# Altium project SensorStation2_Project.PrjPcb
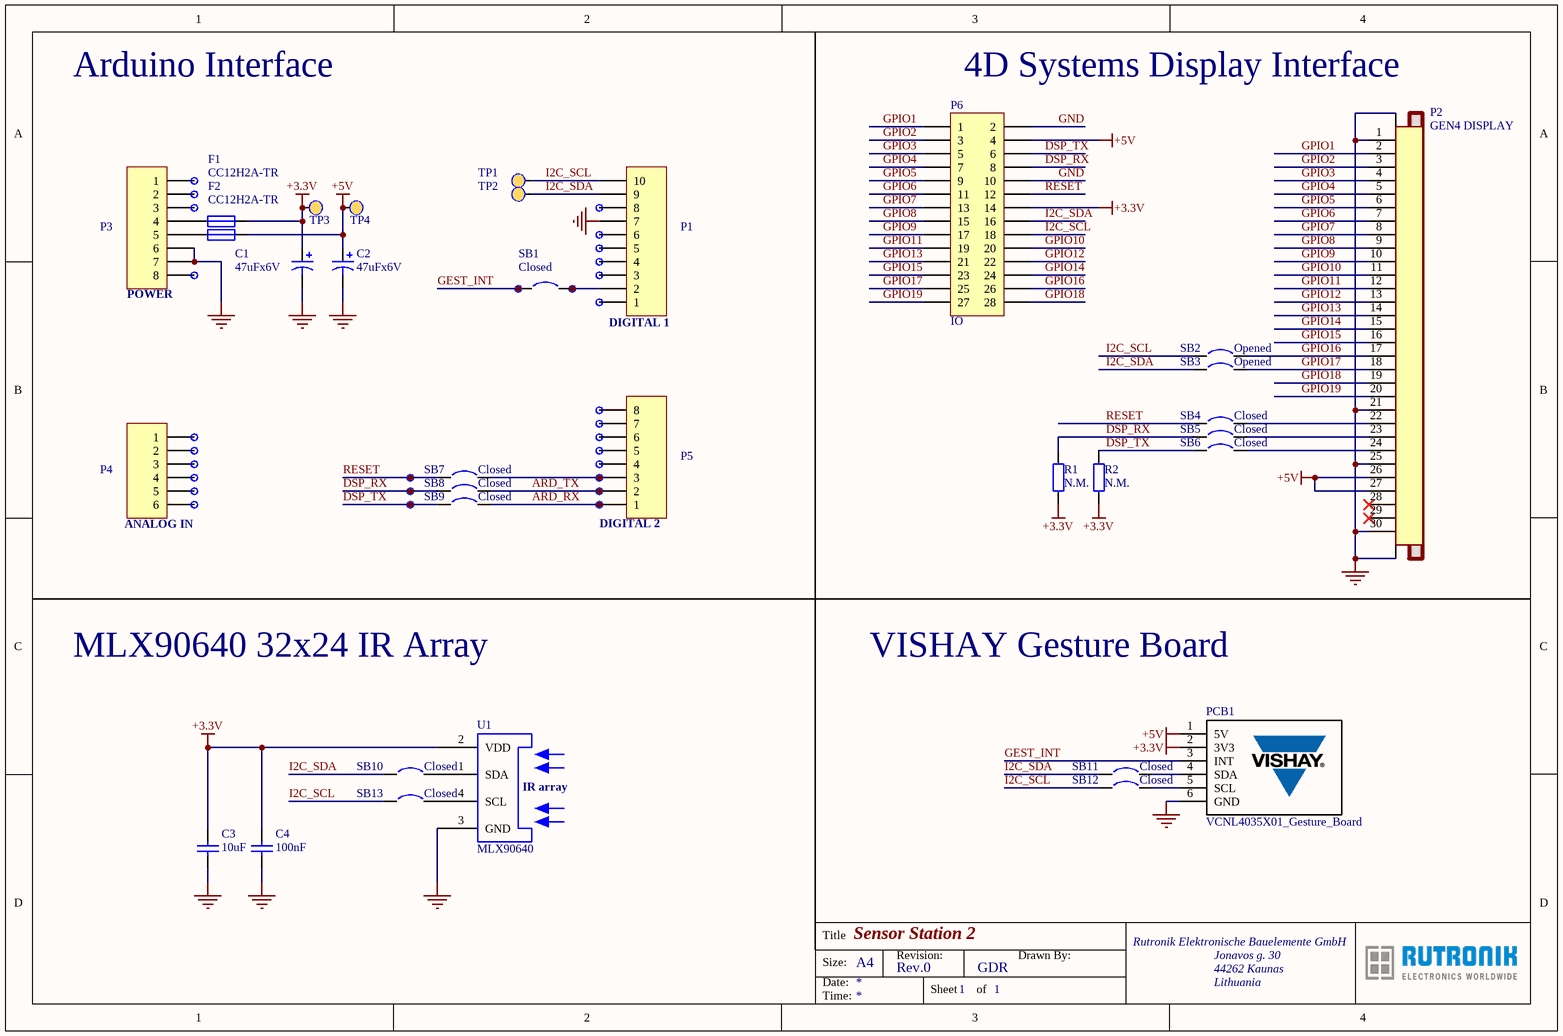
[diagram p0: Schematic.SchDoc]
1 sheet, 62 parts. Net scope: global (net labels, ports and power ports of the same name join across sheets).
Board file: SS2_PCB.PcbDoc

## Sheet Schematic.SchDoc: Sensor Station 2
size A4; DrawnBy: GDR; Organization: Rutronik Elektronische Bauelemente GmbH; Address1: Jonavos g. 30; Address2: 44262 Kaunas; Address3: Lithuania; Revision: Rev.0; SheetNumber: 1; SheetTotal: 1

### Parts
C1  value 47uFx6V  [Case-B]
C2  value 47uFx6V  [Case-B]
C3  value 10uF  [C0805]  (hidden comment: Cap Semi)
C4  value 100nF  [C0805]  (hidden comment: Cap Semi)
F1  CC12H2A-TR  [FUSE1206]
F2  CC12H2A-TR  [FUSE1206]
J1  pin_tht  [PIN_THT]  (value not drawn)  (no BOM)
J2  pin_tht  [PIN_THT]  (value not drawn)  (no BOM)
J3  pin_tht  [PIN_THT]  (value not drawn)  (no BOM)
J4  pin_tht  [PIN_THT]  (value not drawn)  (no BOM)
J5  pin_tht  [PIN_THT]  (value not drawn)  (no BOM)
J6  pin_tht  [PIN_THT]  (value not drawn)  (no BOM)
J7  pin_tht  [PIN_THT]  (value not drawn)  (no BOM)
J8  pin_tht  [PIN_THT]  (value not drawn)  (no BOM)
J9  pin_tht  [PIN_THT]  (value not drawn)  (no BOM)
J10  pin_tht  [PIN_THT]  (value not drawn)  (no BOM)
J11  pin_tht  [PIN_THT]  (value not drawn)  (no BOM)
J12  pin_tht  [PIN_THT]  (value not drawn)  (no BOM)
J13  pin_tht  [PIN_THT]  (value not drawn)  (no BOM)
J14  pin_tht  [PIN_THT]  (value not drawn)  (no BOM)
J15  pin_tht  [PIN_THT]  (value not drawn)  (no BOM)
J16  pin_tht  [PIN_THT]  (value not drawn)  (no BOM)
J17  pin_tht  [PIN_THT]  (value not drawn)  (no BOM)
J18  pin_tht  [PIN_THT]  (value not drawn)  (no BOM)
J19  pin_tht  [PIN_THT]  (value not drawn)  (no BOM)
J20  pin_tht  [PIN_THT]  (value not drawn)  (no BOM)
J21  pin_tht  [PIN_THT]  (value not drawn)  (no BOM)
J22  pin_tht  [PIN_THT]  (value not drawn)  (no BOM)
J23  pin_tht  [PIN_THT]  (value not drawn)  (no BOM)
J24  pin_tht  [PIN_THT]  (value not drawn)  (no BOM)
J25  pin_tht  [PIN_THT]  (value not drawn)  (no BOM)
J26  pin_tht  [PIN_THT]  (value not drawn)  (no BOM)
J27  pin_tht  [PIN_THT]  (value not drawn)  (no BOM)
J28  pin_tht  [PIN_THT]  (value not drawn)  (no BOM)
J29  pin_tht  [PIN_THT]  (value not drawn)  (no BOM)
P1  DIGITAL 1  [HDR1X10_ARDUINO]
P2  GEN4 DISPLAY  [Molex_30pin]
P3  POWER  [HDR1X8_ARDUINO]
P4  ANALOG IN  [HDR1X6_ARDUINO]
P5  DIGITAL 2  [HDR1X8_ARDUINO]
P6  IO  [HDR2X14]  (no BOM)
PCB1  VCNL4035X01_Gesture_Board  [VCNL4035X01_Gesture_Board]
R1  value N.M.  [R0402]  (hidden comment: Res2)  (no BOM)
R2  value N.M.  [R0402]  (hidden comment: Res2)  (no BOM)
SB1  Closed  [SB_0402]
SB2  Opened  [SB_0402 - open]  (no BOM)
SB3  Opened  [SB_0402 - open]  (no BOM)
SB4  Closed  [SB_0402]
SB5  Closed  [SB_0402]
SB6  Closed  [SB_0402]
SB7  Closed  [SB_0402]
SB8  Closed  [SB_0402]
SB9  Closed  [SB_0402]
SB10  Closed  [SB_0402]
SB11  Closed  [SB_0402]
SB12  Closed  [SB_0402]
SB13  Closed  [SB_0402]
TP1  Test_Point  [TEST_POINT]  (value not drawn)  (no BOM)
TP2  Test_Point  [TEST_POINT]  (value not drawn)  (no BOM)
TP3  Test_Point  [TEST_POINT]  (value not drawn)  (no BOM)
TP4  Test_Point  [TEST_POINT]  (value not drawn)  (no BOM)
U1  MLX90640  [TO39-4]

### Nets
+3.3V: C1.1 C3.1 C4.1 F1.1 P6.14 PCB1.2(3V3) R1.2 R2.2 TP3.0 U1.2(VDD)
+5V: C2.1 F2.1 P2.26 P2.27 P6.4 PCB1.1(5V) TP4.0
GND: C1.2 C2.2 C3.2 C4.2 P1.7 P2.1 P2.21 P2.25 P2.30 P2.31 P2.32 P3.6 P3.7 P6.2 P6.10 PCB1.6(GND) U1.3(GND)
ARD_RX: J24.1 P5.1 SB9.2
ARD_TX: J21.1 P5.2 SB8.2
DSP_RX: J20.1 P6.8 R1.1 SB5.1 SB8.1
DSP_TX: J23.1 P6.6 R2.1 SB6.1 SB9.1
GEST_INT: J5.1 PCB1.3(INT) SB1.1
GPIO1: P2.2 P6.1
GPIO2: P2.3 P6.3
GPIO3: P2.4 P6.5
GPIO4: P2.5 P6.7
GPIO5: P2.6 P6.9
GPIO6: P2.7 P6.11
GPIO7: P2.8 P6.13
GPIO8: P2.9 P6.15
GPIO9: P2.10 P6.17
GPIO10: P2.11 P6.20
GPIO11: P2.12 P6.19
GPIO12: P2.13 P6.22
GPIO13: P2.14 P6.21
GPIO14: P2.15 P6.24
GPIO15: P2.16 P6.23
GPIO16: P2.17 P6.26 SB2.2
GPIO17: P2.18 P6.25 SB3.2
GPIO18: P2.19 P6.28
GPIO19: P2.20 P6.27
I2C_SCL: P1.10 P6.18 SB2.1 SB12.1 SB13.1 TP1.0
I2C_SDA: P1.9 P6.16 SB3.1 SB10.1 SB11.1 TP2.0
RESET: J17.1 P6.12 SB4.1 SB7.1
NetF1_2: F1.2 P3.4
NetF2_2: F2.2 P3.5
NetJ1_1: J1.1 P1.6
NetJ2_1: J2.1 P1.5
NetJ3_1: J3.1 P1.4
NetJ4_1: J4.1 P1.3
NetJ6_1: J6.1 P1.2 SB1.2
NetJ7_1: J7.1 P1.1
NetJ8_1: J8.1 P5.8
NetJ9_1: J9.1 P5.7
NetJ10_1: J10.1 P4.1
NetJ11_1: J11.1 P5.6
NetJ12_1: J12.1 P4.2
NetJ13_1: J13.1 P5.5
NetJ14_1: J14.1 P4.3
NetJ15_1: J15.1 P5.4
NetJ16_1: J16.1 P4.4
NetJ18_1: J18.1 P5.3 SB7.2
NetJ19_1: J19.1 P4.5
NetJ22_1: J22.1 P4.6
NetJ25_1: J25.1 P3.1
NetJ26_1: J26.1 P3.2
NetJ27_1: J27.1 P3.3
NetJ28_1: J28.1 P1.8
NetJ29_1: J29.1 P3.8
NetP2_22: P2.22 SB4.2
NetP2_23: P2.23 SB5.2
NetP2_24: P2.24 SB6.2
NetPCB1_4: PCB1.4(SDA) SB11.2
NetPCB1_5: PCB1.5(SCL) SB12.2
NetSB10_2: SB10.2 U1.1(SDA)
NetSB13_2: SB13.2 U1.4(SCL)

Not connected (* = marked no-connect by the designer): P2 28* 29*

### Notes on the sheet
- Arduino Interface
- 4D Systems Display Interface
- MLX90640 32x24 IR Array
- VISHAY Gesture Board
- Title
- Size:
- Date:
- A4
- Revision:
- Drawn By:
- Time:
- Sheet
- of
- (in symbol MLX90640) IR array

### Library data of the parts
C1 C2 = Cap Pol1: Manufacturer: AVX; Manufacturer Part No.: NOJB476M004RWJ; Part Description: Niobium Oxide Capacitor; Specification: 6V, 20%; Supplier: Rutronik; Supplier part number: NOJB476M004RWJ; Link: https://www.rutronik24.com/product/avx/nojb476m004rwj/11635685.html
C3 = Cap Semi: Capacitor (Semiconductor SIM Model); Manufacturer: Samsung EM; Manufacturer Part No.: CGA4J1X7R0J106K125AC; Part Description: Ceramic Capacitor; Specification: X5R, 6.3V, 10%; Supplier: Rutronik; Supplier part number: KKA1042; Link: https://www.rutronik24.com/product/tdk/cga4j1x7r0j106k125ac/14305457.html
C4 = Cap Semi: Capacitor (Semiconductor SIM Model); Manufacturer: TDK; Manufacturer Part No.: CGA2B3X7R1H104K050BB; Part Description: Ceramic Capacitor; Specification: X7R, 50V, 10%; Supplier: Rutronik; Supplier part number: KKA1277; Link: https://www.rutronik24.com/product/tdk/cga2b3x7r1h104k050bb/15441483.html
F1 F2 = Fuse: Manufacturer: EATON; Part Description: High I²t Chip fuse; Specification: 63V, 2A; Link: https://www.rutronik24.com/search-result/qs:CC12H2A-TR/reset:0; Manufacturer Part No.: CC12H2A-TR; Supplier: Rutronik; Supplier part number: FUSE10755; Value: CC12H2A-TR
J1-J29 = pin_tht: Through-hole pin for wire connection.
P1 = Header 10: Manufacturer: ADAM TECH; Manufacturer Part No.: RS1-10-G-413; Part Description: Arduino Connector; Specification: 10 pos. 2,54mm; Value: RS1-10-G-413; Supplier: Rutronik; Supplier part number: CONN9323; Link: http://www.adam-tech.com/products.php
P2 = Molex_30pin: Easy-On FFC/FPC Connector
P3 P5 = Header 8: Manufacturer: ADAM TECH; Manufacturer Part No.: RS1-08-G-413; Part Description: Arduino Connector; Specification: 8 pos. 2,54mm; Value: RS1-08-G-413; Supplier: Rutronik; Supplier part number: CONN9321; Link: http://www.adam-tech.com/products.php
P4 = Header 6: Manufacturer: ADAM TECH; Manufacturer Part No.: RS1-06-G-413; Part Description: Arduino Connector; Specification: 6 pos. 2,54mm; Value: RS1-06-G-413; Supplier: Rutronik; Supplier part number: CONN9319; Link: http://www.adam-tech.com/products.php
P6 = Header 14X2: Header, 14-Pin, Dual row
PCB1 = VCNL4035X01_Gesture_Board: Vishay VCNL4035X01 Gesture Board REV5.0
R1 R2 = Res2: Manufacturer: Yageo; Part Description: Thick Film Resistor; Supplier: Rutronik
SB1-SB13 = Circuit Breaker_close: Circuit Breaker; Manufacturer: Yageo; Manufacturer Part No.: RC04020R; Part Description: Thick Film Resistor; Specification: 5% 0,063W; Value: 0R; Revision: July-2002: Re-released for DXP Platform.; Link: https://www.rutronik24.com/product/yageo/ac0402fr-070rl/1082692.html; Supplier: Rutronik; Supplier part number: WRC52534
TP1-TP4 = Test_Point: Test Point
U1 = MLX90640: MLX90640 32x24 IR array